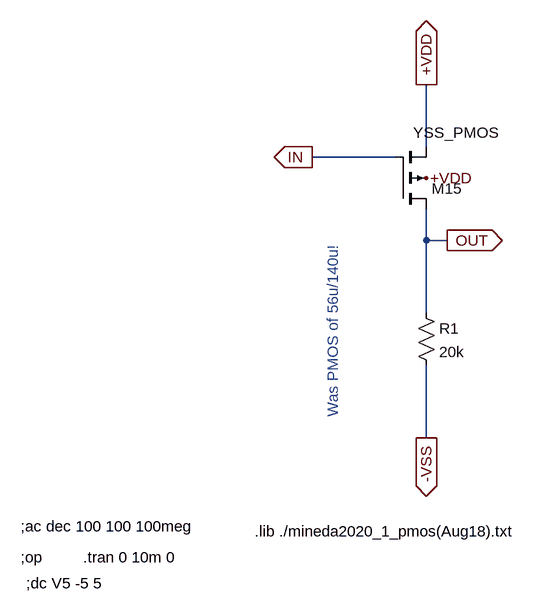
[diagram p0: schematic PMOS-INV.asc]
PMOS-INV.asc, the LTspice schematic file:
Version 4
SHEET 1 2296 2968
WIRE 640 -864 640 -960
WIRE 592 -848 464 -848
WIRE 640 -720 640 -768
WIRE 672 -720 640 -720
WIRE 640 -608 640 -720
WIRE 640 -416 640 -528
FLAG 640 -960 +VDD
IOPIN 640 -960 Out
FLAG 640 -416 -VSS
IOPIN 640 -416 Out
FLAG 640 -816 +VDD
FLAG 672 -720 OUT
IOPIN 672 -720 Out
FLAG 464 -848 IN
IOPIN 464 -848 Out
SYMBOL pmos4 592 -768 M180
WINDOW 3 28 118 Left 2
SYMATTR Value YSS_PMOS
SYMATTR InstName M15
SYMATTR Value2 l=10u w=140u ad=1.96n as=1.96n pd=168u ps=168u
SYMBOL res 624 -624 R0
SYMATTR InstName R1
SYMATTR Value 20k
TEXT 24 -192 Left 2 !;dc V5 -5 5
TEXT 376 -272 Left 2 !.lib ./mineda2020_1_pmos(Aug18).txt
TEXT 16 -232 Left 2 !;op
TEXT 16 -280 Left 2 !;ac dec 100 100 100meg
TEXT 112 -232 Left 2 !.tran 0 10m 0
TEXT 496 -448 VLeft 2 ;Was PMOS of 56u/140u!

The netlist it stands for:
* PMOS-INV.asc
M15 OUT IN +VDD +VDD YSS_PMOS l=10u w=140u ad=1.96n as=1.96n pd=168u ps=168u
R1 OUT -VSS 20k
.model NMOS NMOS
.model PMOS PMOS
.lib standard.mos
;dc V5 -5 5
.lib ./mineda2020_1_pmos(Aug18).txt
;op
;ac dec 100 100 100meg
.tran 0 10m 0
* Was PMOS of 56u/140u!
.backanno
.end